# Altium schematic sheet Power.SchDoc
size A4
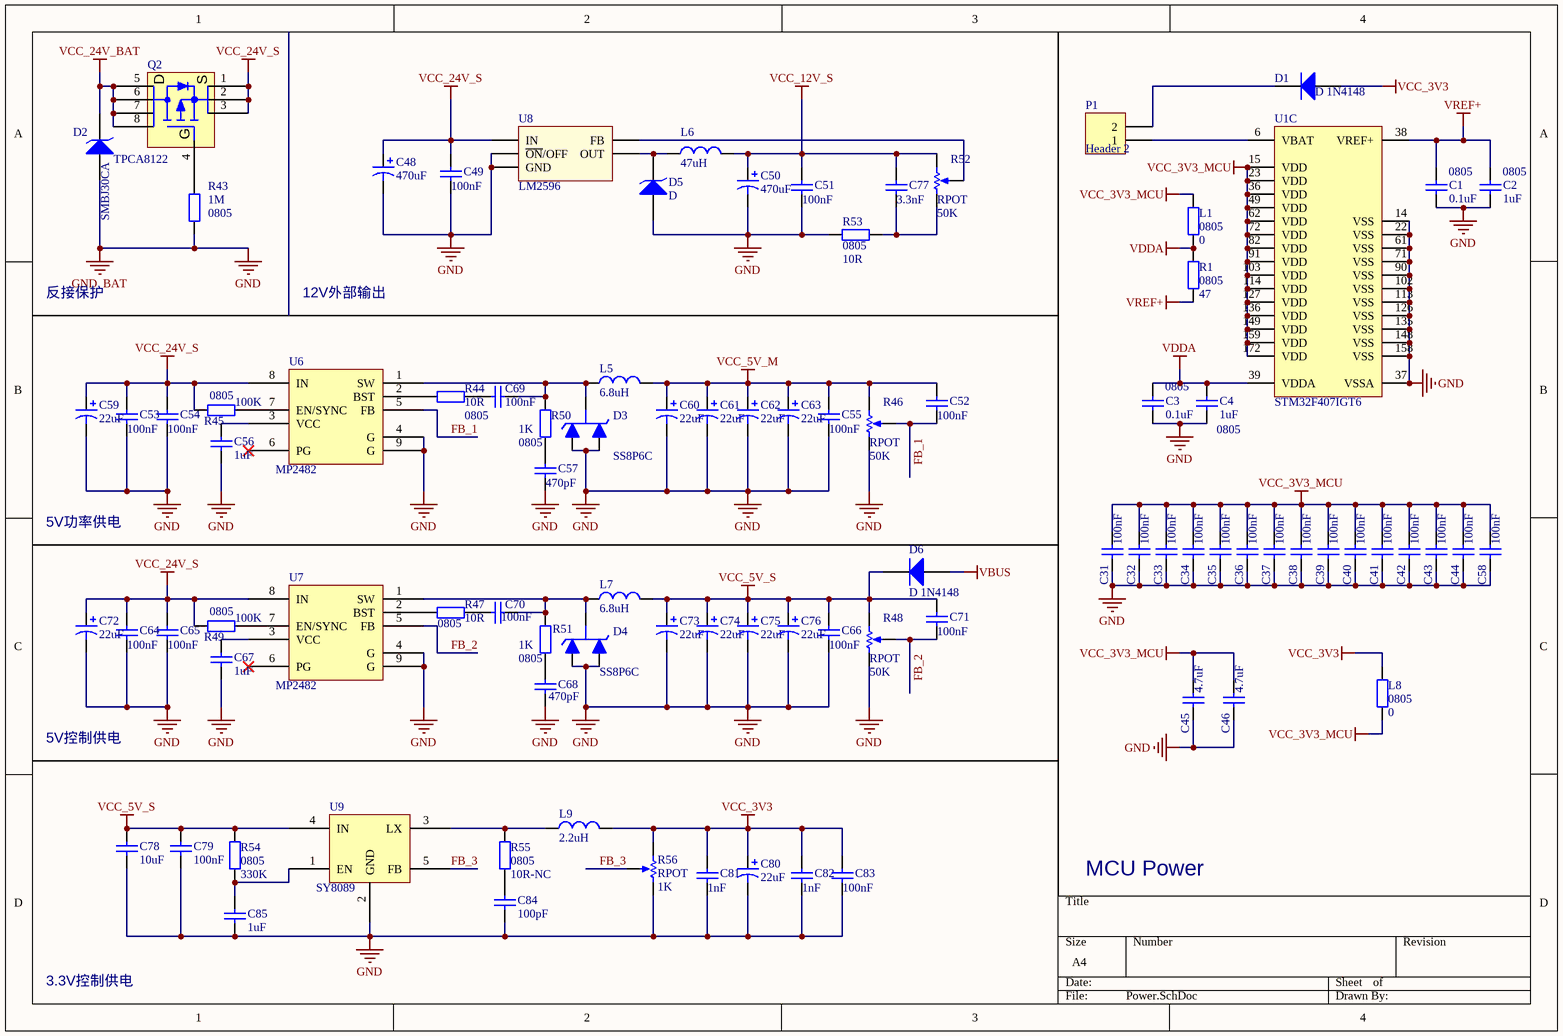
[diagram p0: Power.SchDoc]

## Parts
C1  0805  value 0.1uF  [C 0603_L]
C2  0805  value 1uF  [C 0603_L]
C3  0805  value 0.1uF  [C 0603_L]
C4  0805  value 1uF  [C 0603_L]
C31  value 100nF  [C 0603_L]  (hidden comment: 0805)
C32  value 100nF  [C 0603_L]  (hidden comment: 0805)
C33  value 100nF  [C 0603_L]  (hidden comment: 0805)
C34  value 100nF  [C 0603_L]  (hidden comment: 0805)
C35  value 100nF  [C 0603_L]  (hidden comment: 0805)
C36  value 100nF  [C 0603_L]  (hidden comment: 0805)
C37  value 100nF  [C 0603_L]  (hidden comment: 0805)
C38  value 100nF  [C 0603_L]  (hidden comment: 0805)
C39  value 100nF  [C 0603_L]  (hidden comment: 0805)
C40  value 100nF  [C 0603_L]  (hidden comment: 0805)
C41  value 100nF  [C 0603_L]  (hidden comment: 0805)
C42  value 100nF  [C 0603_L]  (hidden comment: 0805)
C43  value 100nF  [C 0603_L]  (hidden comment: 0805)
C44  value 100nF  [C 0603_L]  (hidden comment: 0805)
C45  value 4.7uF  [C 0805_M]  (hidden comment: 0805)
C46  value 4.7uF  [C 0805_M]  (hidden comment: 0805)
C48  value 470uF  [CM E(8*10.2)]  (hidden comment: CAP-ELEC)
C49  value 100nF  [C 0805_L]  (hidden comment: CAP)
C50  value 470uF  [CM E(8*10.2)]  (hidden comment: CAP-ELEC)
C51  value 100nF  [C 0805_L]  (hidden comment: CAP)
C52  value 100nF  [C 0805_L]  (hidden comment: CAP)
C53  value 100nF  [C 0805_L]  (hidden comment: CAP)
C54  value 100nF  [C 0805_L]  (hidden comment: CAP)
C55  value 100nF  [C 0805_L]  (hidden comment: CAP)
C56  value 1uF  [C 0805_L]  (hidden comment: CAP)
C57  value 470pF  [C 0805_L]  (hidden comment: CAP)
C58  value 100nF  [C 0603_L]  (hidden comment: 0805)
C59  value 22uF  [CD C(6032)]  (hidden comment: CAP-ELEC)
C60  value 22uF  [CD C(6032)]  (hidden comment: CAP-ELEC)
C61  value 22uF  [CD C(6032)]  (hidden comment: CAP-ELEC)
C62  value 22uF  [CD C(6032)]  (hidden comment: CAP-ELEC)
C63  value 22uF  [CD C(6032)]  (hidden comment: CAP-ELEC)
C64  value 100nF  [C 0805_L]  (hidden comment: CAP)
C65  value 100nF  [C 0805_L]  (hidden comment: CAP)
C66  value 100nF  [C 0805_L]  (hidden comment: CAP)
C67  value 1uF  [C 0805_L]  (hidden comment: CAP)
C68  value 470pF  [C 0805_L]  (hidden comment: CAP)
C69  value 100nF  [C 0805_L]  (hidden comment: CAP)
C70  value 100nF  [C 0805_L]  (hidden comment: CAP)
C71  value 100nF  [C 0805_L]  (hidden comment: CAP)
C72  value 22uF  [CD C(6032)]  (hidden comment: CAP-ELEC)
C73  value 22uF  [CD C(6032)]  (hidden comment: CAP-ELEC)
C74  value 22uF  [CD C(6032)]  (hidden comment: CAP-ELEC)
C75  value 22uF  [CD C(6032)]  (hidden comment: CAP-ELEC)
C76  value 22uF  [CD C(6032)]  (hidden comment: CAP-ELEC)
C77  value 3.3nF  [C 0805_L]  (hidden comment: CAP)
C78  value 10uF  [C 0805_L]  (hidden comment: CAP)
C79  value 100nF  [C 0805_L]  (hidden comment: CAP)
C80  value 22uF  [CD C(6032)]  (hidden comment: CAP-ELEC)
C81  value 1nF  [C 0805_L]  (hidden comment: CAP)
C82  value 1nF  [C 0805_L]  (hidden comment: CAP)
C83  value 100nF  [C 0805_L]  (hidden comment: CAP)
C84  value 100pF  [C 0805_L]  (hidden comment: CAP)
C85  value 1uF  [C 0805_L]  (hidden comment: CAP)
D1  D 1N4148  [SOD-523]
D2  SMBJ30CA  [SMB]
D3  SS8P6C  [TO-277]
D4  SS8P6C  [TO-277]
D5  D  [SOD-123]
D6  D 1N4148  [SOD-123]
L1  0805  value 0  [R 0402_L]
L5  value 6.8uH  [L-SMD-10]  (hidden comment: Inductor)
L6  value 47uH  [L-SMD-12]  (hidden comment: Inductor)
L7  value 6.8uH  [L-SMD-10]  (hidden comment: Inductor)
L8  0805  value 0  [R 0402_L]
L9  value 2.2uH  [CD52]  (hidden comment: Inductor)
P1  Header 2  [HDR2.54-LI-2P]
Q2  TPCA8122  [PSOP8]
R1  0805  value 47  [R 0402_L]
R43  0805  value 1M  [R 0805_L]
R44  0805  value 10R  [R 0805_L]
R45  0805  value 100K  [R 0805_L]
R46  RPOT  value 50K  [3296W]
R47  0805  value 10R  [R 0805_L]
R48  RPOT  value 50K  [3296W]
R49  0805  value 100K  [R 0805_L]
R50  0805  value 1K  [R 0805_L]
R51  0805  value 1K  [R 0805_L]
R52  RPOT  value 50K  [3296W]
R53  0805  value 10R  [R 0805_L]
R54  0805  value 330K  [R 0805_L]
R55  0805  value 10R-NC  [R 0805_L]
R56  RPOT  value 1K  [3296W]
U1  STM32F407IGT6  [STM-LQFP176_N]  (part C of 3)
U6  MP2482  [SOIC9N]
U7  MP2482  [SOIC9N]
U8  LM2596  [TO263-5A]
U9  SY8089  [SOT-23-5L]

## Nets
GND: C1.1 C2.1 C3.1 C4.1 C31.1 C32.1 C33.1 C34.1 C35.1 C36.1 C37.1 C38.1 C39.1 C40.1 C41.1 C42.1 C43.1 C44.1 C45.1 C46.1 C48.2 C49.2 C50.2 C51.2 C53.2 C54.2 C55.2 C56.1 C57.1 C58.1 C59.2 C60.2 C61.2 C62.2 C63.2 C64.2 C65.2 C66.2 C67.1 C68.1 C72.2 C73.2 C74.2 C75.2 C76.2 C78.1 C79.1 C80.2 C81.2 C82.2 C83.2 C84.1 C85.1 D2.1(A) D3.1 D3.2 D4.1 D4.2 D5.1(A) R43.1 R46.1 R48.1 R53.2 R56.3 U1.14(VSS) U1.22(VSS) U1.37(VSSA) U1.61(VSS) U1.71(VSS) U1.90(VSS) U1.102(VSS) U1.113(VSS) U1.126(VSS) U1.135(VSS) U1.148(VSS) U1.158(VSS) U6.4(G) U6.9(G) U7.4(G) U7.9(G) U8.3(GND) U8.5(~{ON}/OFF) U9.2(GND)  [also labelled GND_BAT]
VBUS: D6.1(A)
VCC_3V3: C80.1 C81.1 C82.1 C83.1 D1.1(A) L8.2 L9.2 R56.1
VCC_3V3_MCU: C31.2 C32.2 C33.2 C34.2 C35.2 C36.2 C37.2 C38.2 C39.2 C40.2 C41.2 C42.2 C43.2 C44.2 C45.2 C46.2 C58.2 L1.2 L8.1 U1.15(VDD) U1.23(VDD) U1.36(VDD) U1.49(VDD) U1.62(VDD) U1.72(VDD) U1.82(VDD) U1.91(VDD) U1.103(VDD) U1.114(VDD) U1.127(VDD) U1.136(VDD) U1.149(VDD) U1.159(VDD) U1.172(VDD)
VCC_5V_M: C52.1 C55.1 C60.1 C61.1 C62.1 C63.1 L5.2 R46.3
VCC_5V_S: C66.1 C71.1 C73.1 C74.1 C75.1 C76.1 C78.2 C79.2 D6.2(K) L7.2 R48.3 R54.2 U9.4(IN)
VCC_12V_S: C50.1 C51.1 C77.1 L6.2 R52.3
VCC_24V_BAT: D2.2(K) Q2.5 Q2.6 Q2.7 Q2.8
VCC_24V_S: C48.1 C49.1 C53.1 C54.1 C59.1 C64.1 C65.1 C72.1 Q2.1(S) Q2.2(S) Q2.3(S) R45.1 R49.1 U6.8(IN) U7.8(IN) U8.1(IN)
VDDA: C3.2 C4.2 L1.1 R1.2 U1.39(VDDA)
VREF+: C1.2 C2.2 R1.1 U1.38(VREF+)
FB_1: C52.2 R46.2 U6.5(FB)
FB_2: C71.2 R48.2 U7.5(FB)
FB_3: R56.2 U9.5(FB)
NetC56_2: C56.2 U6.3(VCC)
NetC57_2: C57.2 R50.1
NetC67_2: C67.2 U7.3(VCC)
NetC68_2: C68.2 R51.1
NetC69_1: C69.1 D3.3 L5.1 R50.2 U6.1(SW)
NetC69_2: C69.2 R44.2
NetC70_1: C70.1 D4.3 L7.1 R51.2 U7.1(SW)
NetC70_2: C70.2 R47.2
NetC77_2: C77.2 R52.1 R53.1
NetC84_2: C84.2 R55.1
NetC85_2: C85.2 R54.1 U9.1(EN)
NetD1_2: D1.2(K) P1.2
NetD5_2: D5.2(K) L6.1 U8.2(OUT)
NetL9_1: L9.1 R55.2 U9.3(LX)
NetP1_1: P1.1 U1.6(VBAT)
NetQ2_4: Q2.4(G) R43.2
NetR44_1: R44.1 U6.2(BST)
NetR45_2: R45.2 U6.7(EN/SYNC)
NetR47_1: R47.1 U7.2(BST)
NetR49_2: R49.2 U7.7(EN/SYNC)
NetR52_2: R52.2 U8.4(FB)

Not connected (* = marked no-connect by the designer): U6 6(PG)*; U7 6(PG)*

## Notes on the sheet
- 反接保护
- 12V外部输出
- 5V功率供电
- 5V控制供电
- MCU Power
- 3.3V控制供电
- (in symbol TPCA8122) D

## Library data of the parts
C1-C4 C31-C46 C58 = CAP
D1 D6 = D 1N4148: High Conductance Fast Diode; Published: 8-Jun-2000; LatestRevisionDate: 17-Jul-2002; LatestRevisionNote: Re-released for DXP Platform.; DatasheetVersion: 1997; PackageReference: DO-35; Publisher: Altium Limited; PackageDescription: Diode, Axial; Body 3.8 x 1.9 mm (LxDia. max), Lead Dia. 0.53 mm (max); Code_JEDEC: DO-204-AH; ComponentLink1Description: Manufacturer Link; ComponentLink1URL: http://www.fairchildsemi.com/; ComponentLink2Description: Datasheet; ComponentLink2URL: http://www.fairchildsemi.com/ds/1N%2F1N4148.pdf
D2 D5 = D: High Conductance Fast Diode; Published: 8-Jun-2000; LatestRevisionDate: 17-Jul-2002; LatestRevisionNote: Re-released for DXP Platform.; DatasheetVersion: 1997; PackageReference: DO-35; Publisher: Altium Limited; PackageDescription: Diode, Axial; Body 3.8 x 1.9 mm (LxDia. max), Lead Dia. 0.53 mm (max); Code_JEDEC: DO-204-AH; ComponentLink1Description: Manufacturer Link; ComponentLink1URL: http://www.fairchildsemi.com/; ComponentLink2Description: Datasheet; ComponentLink2URL: http://www.fairchildsemi.com/ds/1N%2F1N4148.pdf
L1 L8 R1 R43-R45 R47 R49-R51 R53-R55 = RES2: Resistor; Published: 8-Jun-2000; LatestRevisionDate: 17-Jul-2002; LatestRevisionNote: Re-released for DXP Platform.; PackageReference: AXIAL-0.3; Publisher: Altium Limited; PackageDescription: Axial Device, Thru-Hole; 2 Leads; 0.3 in Pin Spacing
L5-L7 L9 = Inductor: 电感; Code_IEC: 1005; Published: 8-Jun-2000; LatestRevisionDate: 17-Jul-2002; LatestRevisionNote: Re-released for DXP Platform.; PackageReference: 0402-A; Publisher: Altium Limited; Code_JEITA: 0402
P1 = Header 2: Header, 2-Pin; LatestRevisionDate: 17-Jul-2002; LatestRevisionNote: Re-released for DXP Platform.; Publisher: Altium Limited
R46 R48 R52 R56 = RPOT: Potentiometer; Sim Note: Enter the Resistance value and the set point into parameter fields.; Set Position: 0.5; Published: 8-Jun-2000; LatestRevisionDate: 17-Jul-2002; LatestRevisionNote: Re-released for DXP Platform.; PackageReference: VR5; Publisher: Altium Limited; PackageDescription: Variable Resistor, Thru-Hole; 3 Leads
U1 = STM32F407IGT6: ARM Cortex-M4 32-bit MCU+FPU, 210 DMIPS, 1024 kB Flash, 192 kB Internal RAM, 140 I/Os, 176-pin LQFP, -40 to 85 degC, Tray; Manufacturer: STMicroelectronics; D/A Converter: 2x12-bit; FLASH Size (Prog) (kB): 1024; I/Os (High Current): 140; Internal RAM Size (kB): 192; Operating Frequency(F) (Processor speed) (MHz): 168; Supply Voltage(Vcc) max (V): 3.6; Supply Voltage(Vcc) min (V): 1.8; DatasheetVersion: Rev. 4; PackageVersion: Rev. 4, 06/2013; PackageReference: LQFP176; PackageDescription: 176-Pin Low Profile Quad Flat Package, 24 x 24 mm Body, 0.5 mm Pitch; Supplier 1: Digi-Key; Supplier Part Number 1: 497-11604-ND; Supplier 2: Farnell; Supplier Part Number 2: 2064366; Supplier 3: Newark; Supplier Part Number 3: 73T2331; Supplier 4: Mouser; Supplier Part Number 4: 511-STM32F407IGT6; Core: ARM Cortex-M4; Packing: Tray; Mounting Technology: Surface Mount; PartNumber: STM32F407IGT6; ComponentLink1Description: Manufacturer URL; ComponentLink1URL: http://www.st.com/web/en/home.html; ComponentLink2Description: Datasheet; ComponentLink2URL: http://www.st.com/st-web-ui/static/active/en/resource/technical/document/datasheet/DM00037051.pdf; ComponentLink3Description: Package Specification; ComponentLink3URL: http://www.st.com/st-web-ui/static/active/en/resource/technical/document/datasheet/DM00035129.pdf
U8 = LM2576S